# EAGLE design lada_v2 (EAGLE 7.2.0)
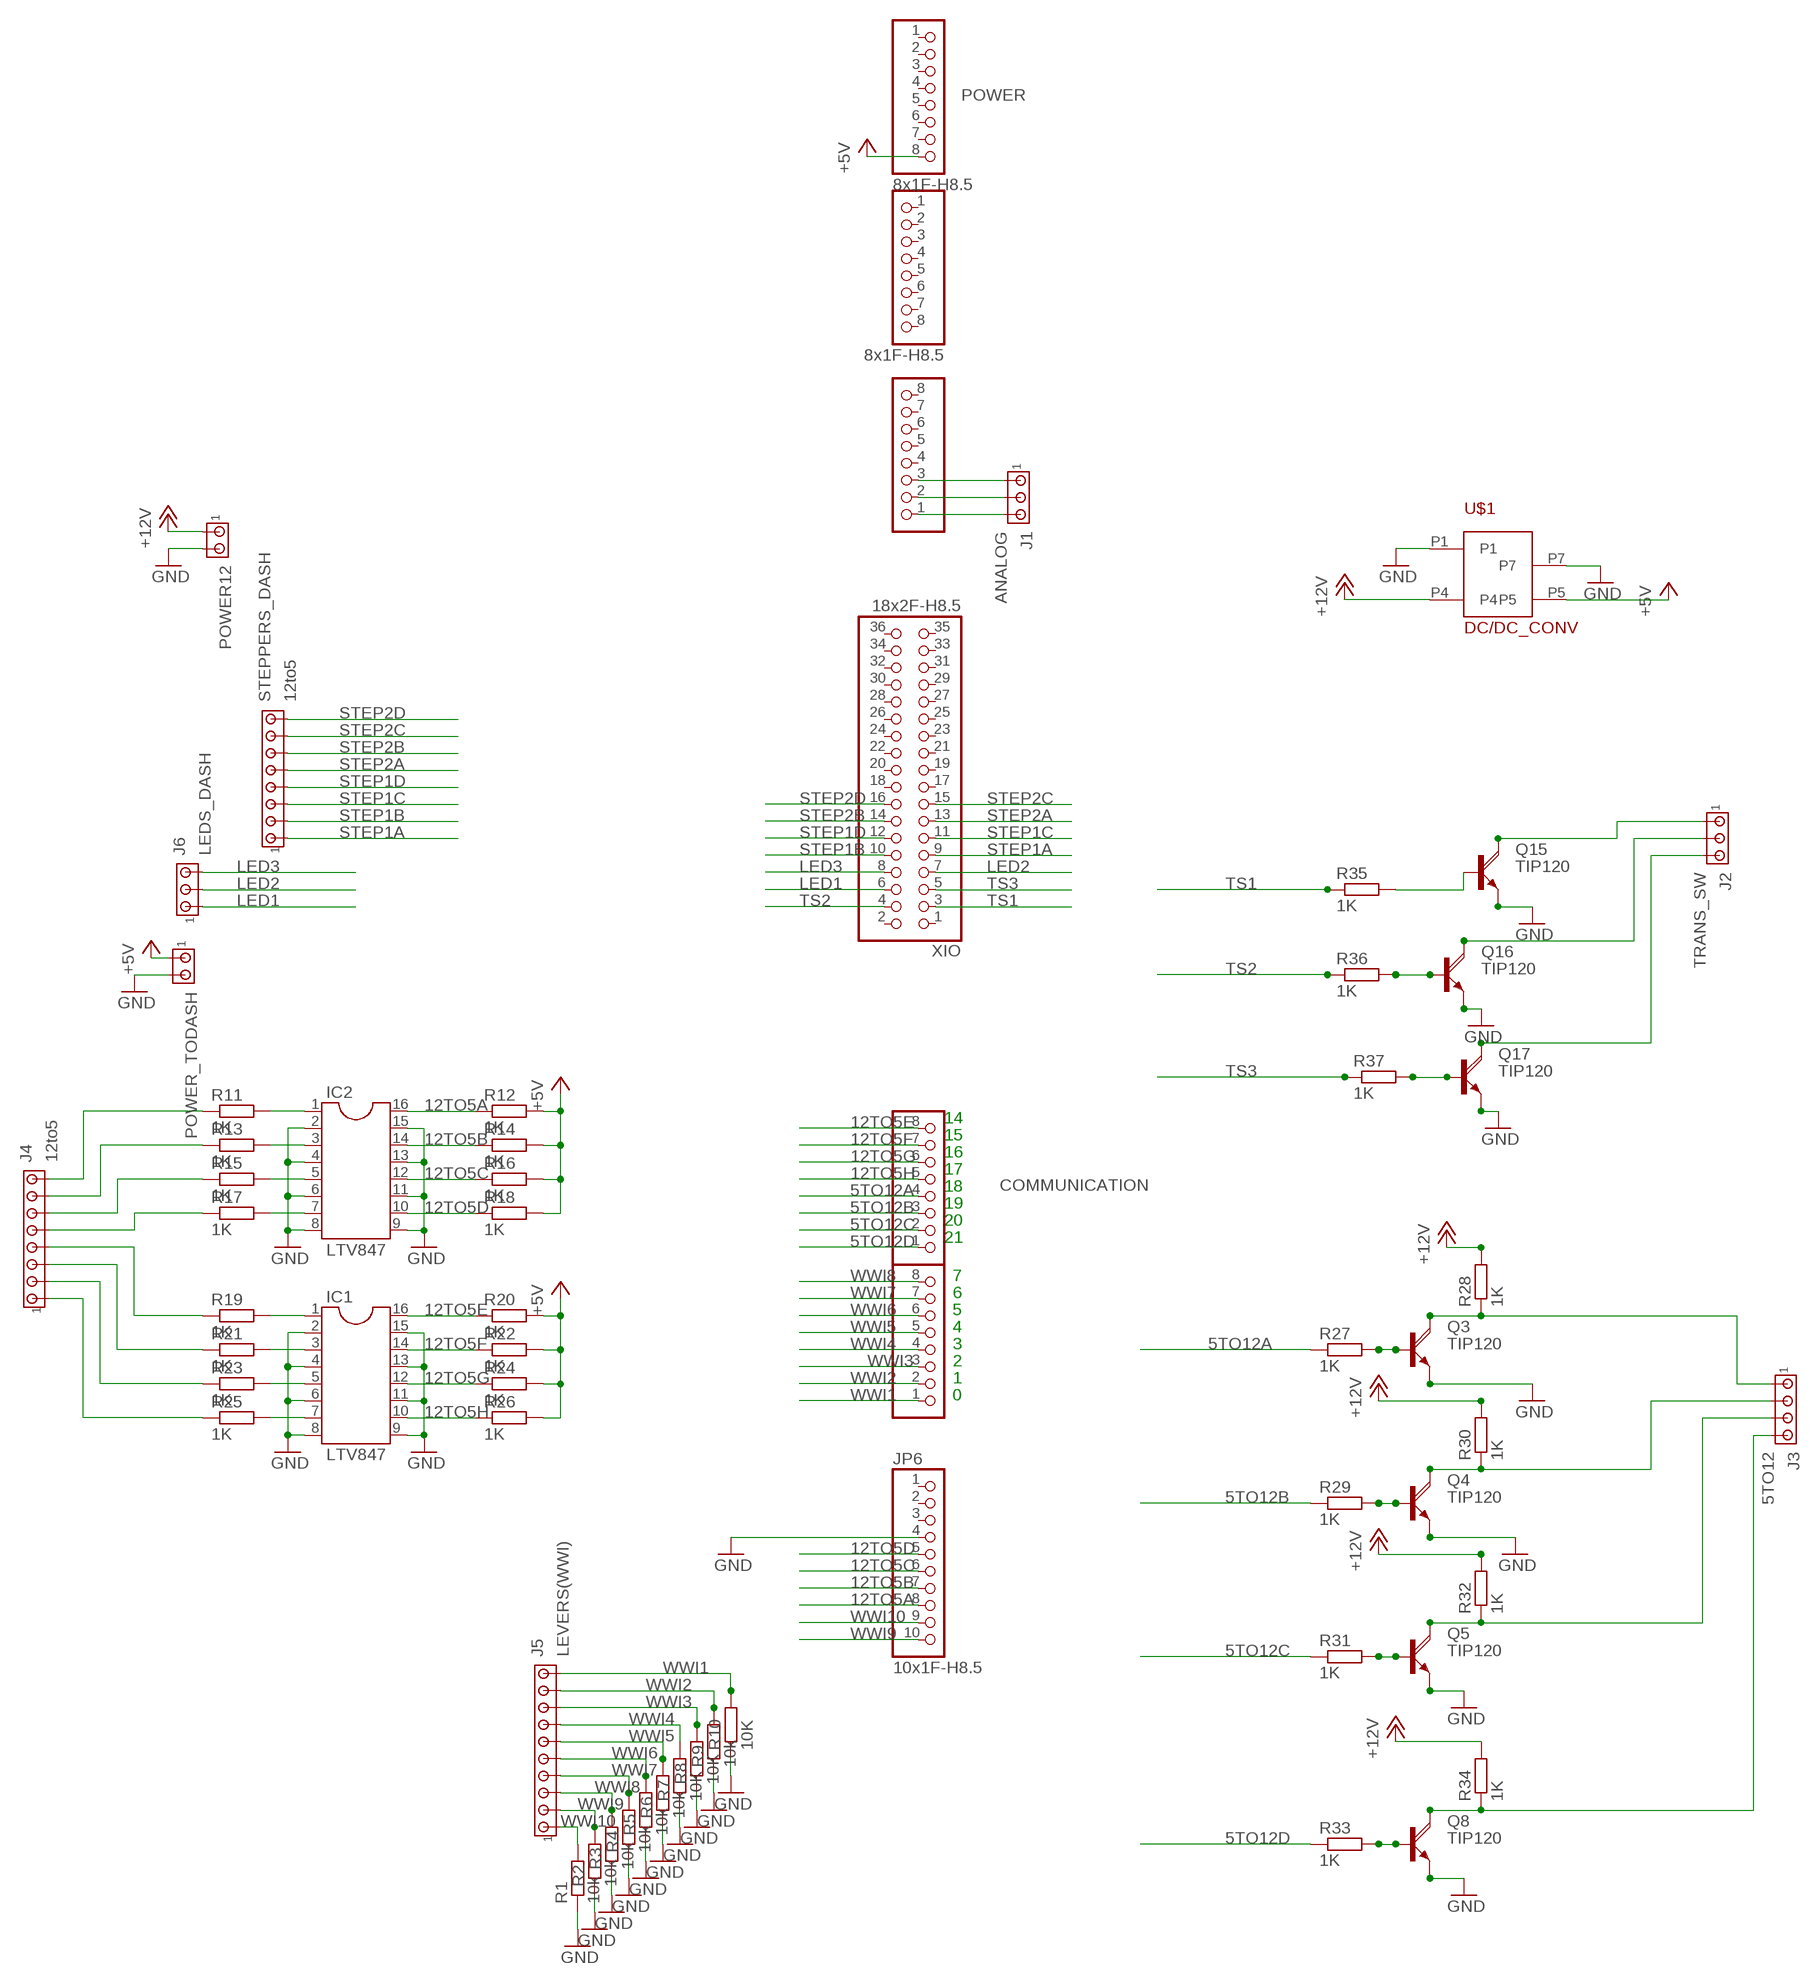
[diagram p0: schematic, sheet 1]

## Parts
ADCH  8x1F-H8.5  PINHD-1X8  [1X08]
ADCL  8x1F-H8.5  PINHD-1X8  [1X08]
COMMUNICATION  8x1F-H8.5  PINHD-1X8  [1X08]
IC1  LTV847  DIL16  [DIL16]
IC2  LTV847  DIL16  [DIL16]
J1  ANALOG  MTA03-100  [10X03MTA]
J2  TRANS_SW  MTA03-100  [10X03MTA]
J3  5TO12  MTA04-100  [10X04MTA]
J4  12to5  MTA08-100  [10X08MTA]
J5  LEVERS(WWI)  MTA10-100  [10X10MTA]
J6  LEDS_DASH  MTA03-100  [10X03MTA]
JP6  10x1F-H8.5  PINHD-1X10_ARD  [1X10]
POWER  8x1F-H8.5  PINHD-1X8  [1X08]
POWER12  MTA02-100  [10X02MTA]
POWER_TODASH  MTA02-100  [10X02MTA]
PWML  8x1F-H8.5  PINHD-1X8  [1X08]
Q3  TIP120  [TO220AH]
Q4  TIP120  [TO220AH]
Q5  TIP120  [TO220AH]
Q8  TIP120  [TO220AH]
Q15  TIP120  [TO220AH]
Q16  TIP120  [TO220AH]
Q17  TIP120  [TO220AH]
R1  10k  R-EU_0207/10  [0207/10]
R2  10k  R-EU_0207/10  [0207/10]
R3  10k  R-EU_0207/10  [0207/10]
R4  10k  R-EU_0207/10  [0207/10]
R5  10k  R-EU_0207/10  [0207/10]
R6  10k  R-EU_0207/10  [0207/10]
R7  10K  R-EU_0207/10  [0207/10]
R8  10K  R-EU_0207/10  [0207/10]
R9  10k  R-EU_0207/10  [0207/10]
R10  10K  R-EU_0207/10  [0207/10]
R11  1K  R-EU_0207/10  [0207/10]
R12  1K  R-EU_0207/10  [0207/10]
R13  1K  R-EU_0207/10  [0207/10]
R14  1K  R-EU_0207/10  [0207/10]
R15  1K  R-EU_0207/10  [0207/10]
R16  1K  R-EU_0207/10  [0207/10]
R17  1K  R-EU_0207/10  [0207/10]
R18  1K  R-EU_0207/10  [0207/10]
R19  1K  R-EU_0207/10  [0207/10]
R20  1K  R-EU_0207/10  [0207/10]
R21  1K  R-EU_0207/10  [0207/10]
R22  1K  R-EU_0207/10  [0207/10]
R23  1K  R-EU_0207/10  [0207/10]
R24  1K  R-EU_0207/10  [0207/10]
R25  1K  R-EU_0207/10  [0207/10]
R26  1K  R-EU_0207/10  [0207/10]
R27  1K  R-EU_0207/10  [0207/10]
R28  1K  R-EU_0207/10  [0207/10]
R29  1K  R-EU_0207/10  [0207/10]
R30  1K  R-EU_0207/10  [0207/10]
R31  1K  R-EU_0207/10  [0207/10]
R32  1K  R-EU_0207/10  [0207/10]
R33  1K  R-EU_0207/10  [0207/10]
R34  1K  R-EU_0207/10  [0207/10]
R35  1K  R-EU_0207/10  [0207/10]
R36  1K  R-EU_0207/10  [0207/10]
R37  1K  R-EU_0207/10  [0207/10]
STEPPERS_DASH  12to5  MTA08-100  [10X08MTA]
U$1  DC/DC_CONV  [DC/DC_CONV]
XIO  18x2F-H8.5  PINHD-2X18  [2X18]

## Nets
5TO12A: COMMUNICATION.4 R27.1
5TO12B: COMMUNICATION.3 R29.1
5TO12C: COMMUNICATION.2 R31.1
5TO12D: COMMUNICATION.1 R33.1
12TO5A: IC2.16 JP6.8 R12.1
12TO5B: IC2.14 JP6.7 R14.1
12TO5C: IC2.12 JP6.6 R16.1
12TO5D: IC2.10 JP6.5 R18.1
12TO5E: COMMUNICATION.8 IC1.16 R20.1
12TO5F: COMMUNICATION.7 IC1.14 R22.1
12TO5G: COMMUNICATION.6 IC1.12 R24.1
12TO5H: COMMUNICATION.5 IC1.10 R26.1
+5V: POWER.8 POWER_TODASH.1 R12.2 R14.2 R16.2 R18.2 R20.2 R22.2 R24.2 R26.2 U$1.P5
+12V: POWER12.1 R28.2 R30.2 R32.2 R34.2 U$1.P4
GND: IC1.2 IC1.4 IC1.6 IC1.8 IC1.9 IC1.11 IC1.13 IC1.15 IC2.2 IC2.4 IC2.6 IC2.8 IC2.9 IC2.11 IC2.13 IC2.15 JP6.4 POWER12.2 POWER_TODASH.2 Q3.E Q4.E Q5.E Q8.E Q15.E Q16.E Q17.E R1.1 R2.1 R3.1 R4.1 R5.1 R6.1 R7.1 R8.1 R9.1 R10.1 U$1.P1 U$1.P7
LED1: J6.1 XIO.6
LED2: J6.2 XIO.7
LED3: J6.3 XIO.8
N$2: ADCH.1 J1.3
N$8: Q15.B R35.2
N$9: ADCH.2 J1.2
N$11: ADCH.3 J1.1
N$60: J3.1 Q3.C R28.1
N$61: J3.2 Q4.C R30.1
N$62: J3.3 Q5.C R32.1
N$63: Q5.B R31.2
N$64: Q4.B R29.2
N$65: Q3.B R27.2
N$80: J3.4 Q8.C R34.1
N$81: Q8.B R33.2
N$100: J2.1 Q15.C
N$103: J2.2 Q16.C
N$104: Q16.B R36.2
N$106: J2.3 Q17.C
N$107: Q17.B R37.2
N$120: IC1.1 R19.2
N$121: IC1.3 R21.2
N$122: IC1.5 R23.2
N$123: IC1.7 R25.2
N$128: IC2.1 R11.2
N$129: IC2.3 R13.2
N$130: IC2.5 R15.2
N$131: IC2.7 R17.2
N$132: J4.8 R11.1
N$133: J4.7 R13.1
N$134: J4.6 R15.1
N$135: J4.5 R17.1
N$136: J4.4 R19.1
N$137: J4.3 R21.1
N$138: J4.2 R23.1
N$139: J4.1 R25.1
STEP1A: STEPPERS_DASH.1 XIO.9
STEP1B: STEPPERS_DASH.2 XIO.10
STEP1C: STEPPERS_DASH.3 XIO.11
STEP1D: STEPPERS_DASH.4 XIO.12
STEP2A: STEPPERS_DASH.5 XIO.13
STEP2B: STEPPERS_DASH.6 XIO.14
STEP2C: STEPPERS_DASH.7 XIO.15
STEP2D: STEPPERS_DASH.8 XIO.16
TS1: R35.1 XIO.3
TS2: R36.1 XIO.4
TS3: R37.1 XIO.5
WWI1: J5.10 PWML.1 R10.2
WWI2: J5.9 PWML.2 R9.2
WWI3: J5.8 PWML.3 R8.2
WWI4: J5.7 PWML.4 R7.2
WWI5: J5.6 PWML.5 R6.2
WWI6: J5.5 PWML.6 R5.2
WWI7: J5.4 PWML.7 R4.2
WWI8: J5.3 PWML.8 R3.2
WWI9: J5.2 JP6.10 R2.2
WWI10: J5.1 JP6.9 R1.2
Unconnected: ADCH.4 ADCH.5 ADCH.6 ADCH.7 ADCH.8 ADCL.1 ADCL.2 ADCL.3 ADCL.4 ADCL.5 ADCL.6 ADCL.7 ADCL.8 JP6.1 JP6.2 JP6.3 POWER.1 POWER.2 POWER.3 POWER.4 POWER.5 POWER.6 POWER.7 XIO.1 XIO.2 XIO.17 XIO.18 XIO.19 XIO.20 XIO.21 XIO.22 XIO.23 XIO.24 XIO.25 XIO.26 XIO.27 XIO.28 XIO.29 XIO.30 XIO.31 XIO.32 XIO.33 XIO.34 XIO.35 XIO.36

## Notes on the sheet
- 14
- 15
- 16
- 17
- 18
- 19
- 20
- 21
- 7
- 6
- 5
- 4
- 3
- 2
- 1
- 0

## Library data of the parts
ADCH ADCL COMMUNICATION POWER PWML = SmartPrj:PINHD-1X8: PIN HEADER
IC1 IC2 = ic-package:DIL16: Dual In Line / Socket
J1 J2 J6 = con-amp:MTA03-100: AMP connector
J3 = con-amp:MTA04-100: AMP connector
J4 STEPPERS_DASH = con-amp:MTA08-100: AMP connector
J5 = con-amp:MTA10-100: AMP connector
JP6 = SmartPrj:PINHD-1X10_ARD: PIN HEADER
POWER12 POWER_TODASH = con-amp:MTA02-100: AMP connector
Q3-Q5 Q8 Q15-Q17 = transistor-power:TIP120: NPN DARLINGTON TRANSISTOR
R1-R37 = rcl:R-EU_: RESISTOR, European symbol
U$1 = dc-dc_meanwell:DC/DC_CONV
XIO = SmartPrj:PINHD-2X18: PIN HEADER

## Net classes
0 default: width 0.203 mm, drill 0.406 mm, clearance 0.203 mm

## Board
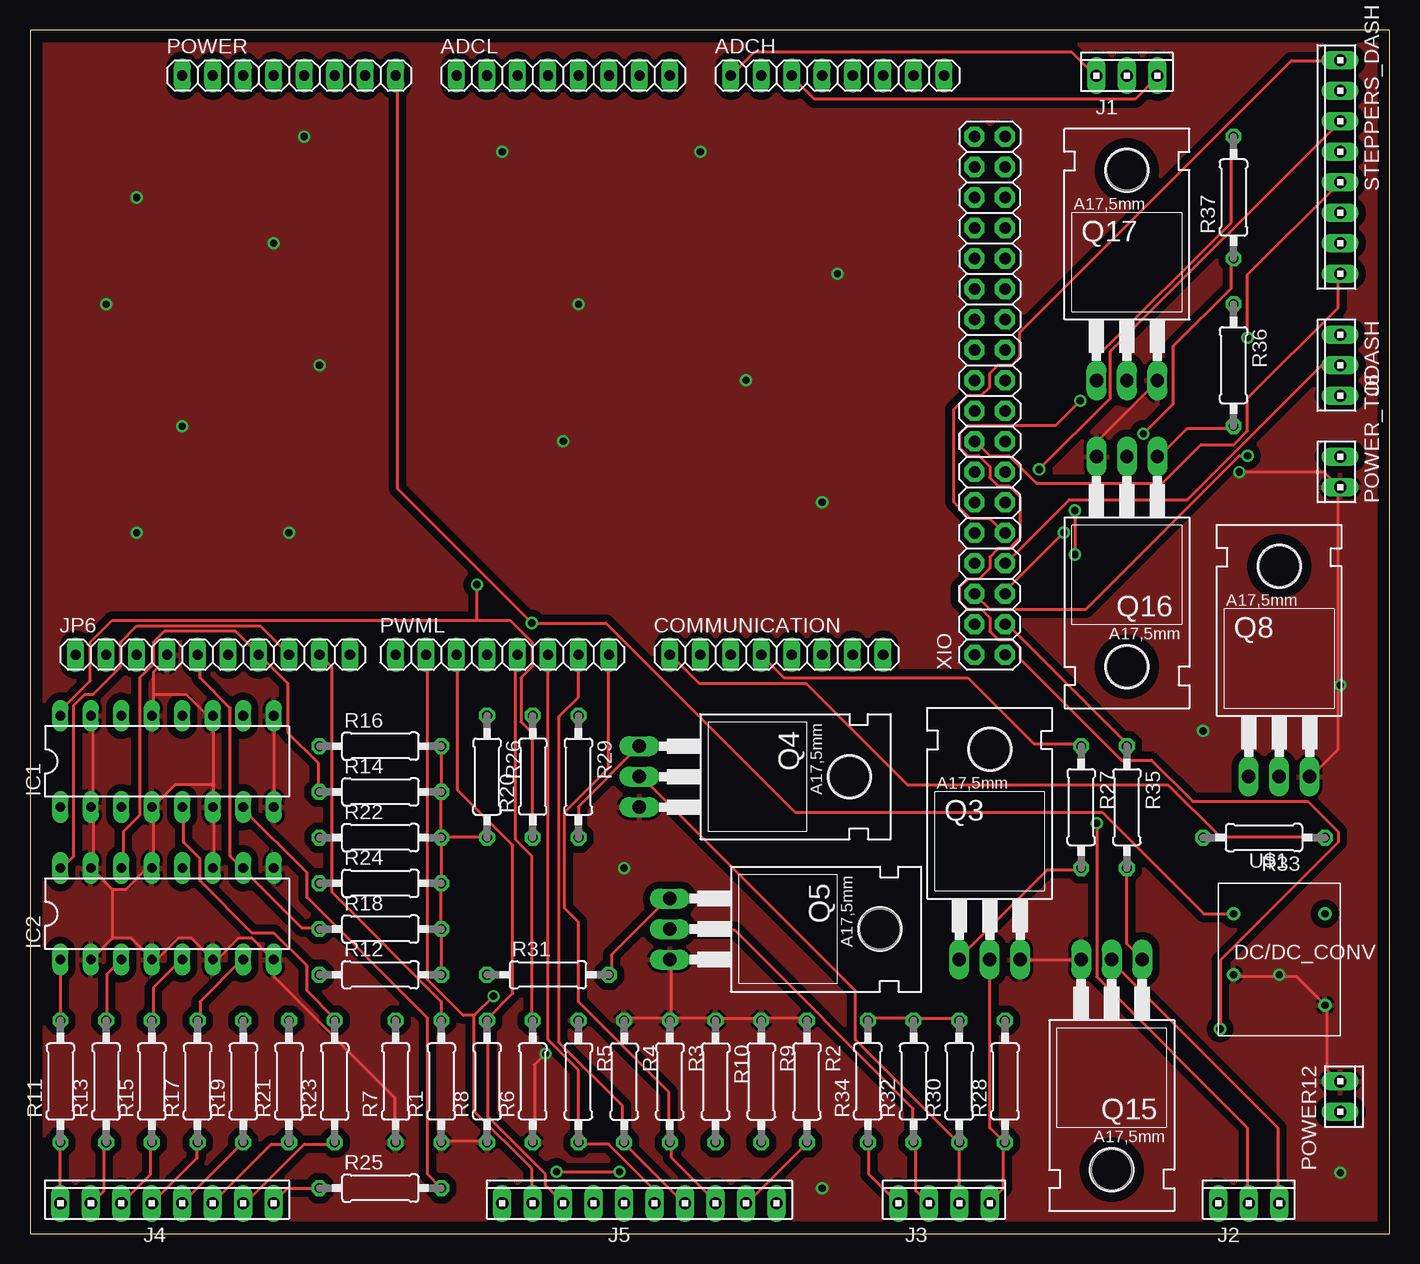
[diagram p1: board, top side]
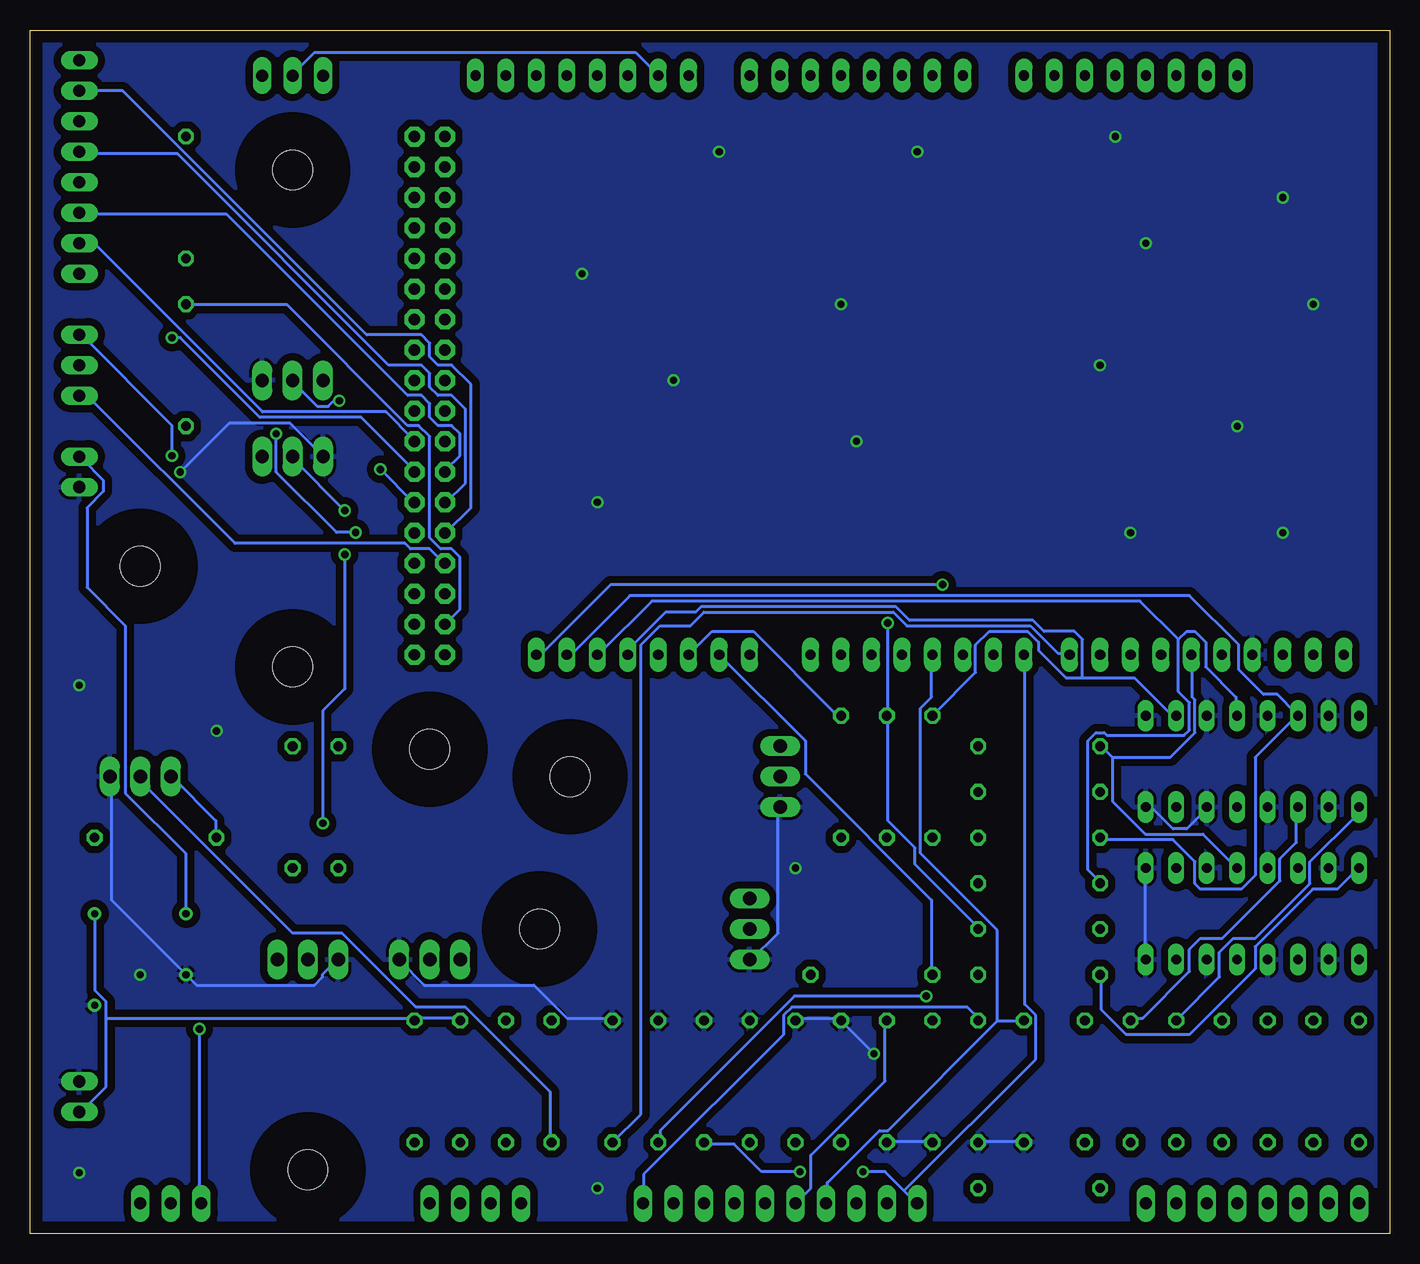
[diagram p2: board, bottom side, seen from below]

Size 113.33 x 100.32 mm. Coordinates in mm from the lower left corner, seen from the top.
Outline: 0,0 113.33,0 113.33,100.32 0,100.32 0,0
Copper layers (1*16): Top 0.035mm / dielectric 1.5mm / Bottom 0.035mm
Design rules "default *": minimum track width 10mil, minimum drill 20mil, track to track 8mil, track to pad 8mil, pad to pad 8mil, via to via 8mil, smd to smd 8mil, copper to edge 40mil, drill to drill 8mil, minimum pad ring 10mil, minimum via ring 8mil, stop-mask expansion 4mil, vias tented up to drill 0mil, thermal gap 10mil

### Footprints (pad centres in the part's own frame; a part is rotated, then mirrored left to right if it is on the bottom)
1X08 = drill 0.85 pad 1.422 long: 1 -8.89,0; 2 -6.35,0; 3 -3.81,0; 4 -1.27,0; 5 1.27,0; 6 3.81,0; 7 6.35,0; 8 8.89,0
DIL16 = drill 0.813 long: 1 -8.89,-3.81; 2 -6.35,-3.81; 3 -3.81,-3.81; 4 -1.27,-3.81; 5 1.27,-3.81; 6 3.81,-3.81; 7 6.35,-3.81; 8 8.89,-3.81; 9 8.89,3.81; 10 6.35,3.81; 11 3.81,3.81; 12 1.27,3.81; 13 -1.27,3.81; 14 -3.81,3.81; 15 -6.35,3.81; 16 -8.89,3.81
10X03MTA = drill 1.016 long: 1 2.54,0; 2 0,0; 3 -2.54,0
10X04MTA = drill 1.016 long: 1 3.81,0; 2 1.27,0; 3 -1.27,0; 4 -3.81,0
10X08MTA = drill 1.016 long: 1 8.89,0; 2 6.35,0; 3 3.81,0; 4 1.27,0; 5 -1.27,0; 6 -3.81,0; 7 -6.35,0; 8 -8.89,0
10X10MTA = drill 1.016 long: 1 11.43,0; 2 8.89,0; 3 6.35,0; 4 3.81,0; 5 1.27,0; 6 -1.27,0; 7 -3.81,0; 8 -6.35,0; 9 -8.89,0; 10 -11.43,0
1X10 = drill 0.85 pad 1.422 long: 1 -11.43,0; 2 -8.89,0; 3 -6.35,0; 4 -3.81,0; 5 -1.27,0; 6 1.27,0; 7 3.81,0; 8 6.35,0; 9 8.89,0; 10 11.43,0
10X02MTA = drill 1.016 long: 1 1.27,0; 2 -1.27,0
TO220AH = drill 1.118 long: B -2.54,-6.35; C 0,-6.35; E 2.54,-6.35 | hole 3.302: 0,11.176
0207/10 = drill 0.813 octagon: 1 -5.08,0; 2 5.08,0
DC/DC_CONV = drill 0.6: P1 8.89,2.54; P4 8.89,10.16; P5 1.27,10.16; P7 1.27,5.08
2X18 = drill 0.95 pad 1.676 octagon: 1 -21.59,-1.27; 2 -21.59,1.27; 3 -19.05,-1.27; 4 -19.05,1.27; 5 -16.51,-1.27; 6 -16.51,1.27; 7 -13.97,-1.27; 8 -13.97,1.27; 9 -11.43,-1.27; 10 -11.43,1.27; 11 -8.89,-1.27; 12 -8.89,1.27; 13 -6.35,-1.27; 14 -6.35,1.27; 15 -3.81,-1.27; 16 -3.81,1.27; 17 -1.27,-1.27; 18 -1.27,1.27; 19 1.27,-1.27; 20 1.27,1.27; 21 3.81,-1.27; 22 3.81,1.27; 23 6.35,-1.27; 24 6.35,1.27; 25 8.89,-1.27; 26 8.89,1.27; 27 11.43,-1.27; 28 11.43,1.27; 29 13.97,-1.27; 30 13.97,1.27; 31 16.51,-1.27; 32 16.51,1.27; 33 19.05,-1.27; 34 19.05,1.27; 35 21.59,-1.27; 36 21.59,1.27

### Placement (x,y rotation side)
ADCH  67.31,96.52 0 top
ADCL  44.45,96.52 0 top
COMMUNICATION  62.23,48.26 0 top
IC1  11.43,39.37 0 top
IC2  11.43,26.67 0 top
J1  91.44,96.52 0 top
J2  101.6,2.54 0 top
J3  76.2,2.54 0 top
J4  11.43,2.54 0 top
J5  50.8,2.54 0 top
J6  109.22,72.39 90 top
JP6  15.24,48.26 0 top
POWER  21.59,96.52 0 top
POWER12  109.22,11.43 270 top
POWER_TODASH  109.22,63.5 90 top
PWML  39.37,48.26 0 top
Q3  80.01,29.21 0 top
Q4  57.15,38.1 270 top
Q5  59.69,25.4 270 top
Q8  104.14,44.45 0 top
Q15  90.17,16.51 180 top
Q16  91.44,58.42 180 top
Q17  91.44,77.47 0 top
R1  34.29,12.7 90 top
R2  64.77,12.7 270 top
R3  53.34,12.7 270 top
R4  49.53,12.7 270 top
R5  45.72,12.7 270 top
R6  41.91,12.7 90 top
R7  30.48,12.7 90 top
R8  38.1,12.7 90 top
R9  60.96,12.7 270 top
R10  57.15,12.7 270 top
R11  2.54,12.7 90 top
R12  29.21,21.59 0 top
R13  6.35,12.7 90 top
R14  29.21,36.83 0 top
R15  10.16,12.7 90 top
R16  29.21,40.64 0 top
R17  13.97,12.7 90 top
R18  29.21,25.4 0 top
R19  17.78,12.7 90 top
R20  41.91,38.1 90 top
R21  21.59,12.7 90 top
R22  29.21,33.02 0 top
R23  25.4,12.7 90 top
R24  29.21,29.21 0 top
R25  29.21,3.81 0 top
R26  38.1,38.1 270 top
R27  87.63,35.56 270 top
R28  81.28,12.7 90 top
R29  45.72,38.1 270 top
R30  77.47,12.7 90 top
R31  43.18,21.59 0 top
R32  73.66,12.7 90 top
R33  102.87,33.02 180 top
R34  69.85,12.7 90 top
R35  91.44,35.56 270 top
R36  100.33,72.39 270 top
R37  100.33,86.36 90 top
STEPPERS_DASH  109.22,88.9 90 top
U$1  99.06,16.51 0 top
XIO  80.01,69.85 90 top

### Tracks (layer width: path | path; a pad name or v marks a point on that pad's centre or on a via)
5TO12A
  Top 0.254: R27.1 87.55,40.84 83.67,40.84 78.18,46.33 62.87,46.33 61.04,48.16 COMMUNICATION.4
5TO12B
  Bottom 0.254: COMMUNICATION.3 56.46,50.22 53.03,50.22 46.18,43.36 45.72,43.36 R29.1
5TO12C
  Bottom 0.254: COMMUNICATION.2 48.69,41.07 48.69,38.33 38.18,27.81 38.18,21.64 R31.1
5TO12D
  Top 0.254: R33.1 107.9,33.07 99.21,33.07 94.87,37.41 73.15,37.41 64.69,45.87 55.78,45.87 53.49,48.16 COMMUNICATION.1
12TO5A
  Top 0.254: JP6.8 21.49,48.39 19.2,50.67 8.91,50.67 7.54,49.3 7.54,47.24 5.26,44.96 4.57,44.96 3.66,44.04 3.66,31.47 2.74,30.56 IC2.16
  Bottom 0.254: R12.1 24,21.41 24,18.67 21.95,16.61 16.69,16.61 11.2,22.1 11.2,23.93 6.4,28.73 4.34,28.73 2.74,30.33 IC2.16
12TO5B
  Top 0.254: IC2.14 7.77,30.56 7.77,33.53 9.14,34.9 9.14,46.33 10.29,47.47 10.29,49.3 11.2,50.22 17.14,50.22 18.97,48.39 JP6.7 19.2,48.16 21.49,45.87 21.49,41.76 24,39.24 24,36.96 R14.1
12TO5C
  Bottom 0.254: 23.09,39.7 23.09,36.04 20.34,33.3 15.54,33.3 12.8,30.56 IC2.12 | 23.09,39.7 24,40.62 R16.1 | 23.09,39.7 18.29,39.7 16.23,41.76 16.23,44.5 16.46,44.73 16.46,48.16 JP6.6
12TO5D
  Top 0.254: R18.1 24,25.53 22.63,25.53 17.83,30.33 IC2.10 17.6,30.56 16.69,31.47 16.69,43.81 14.17,46.33 14.17,48.16 JP6.5
12TO5E  (via drill 0.61)
  Top 0.254: 37.26,51.13 6.86,51.13 5.03,49.3 5.03,46.1 2.74,43.81 2.74,43.36 IC1.16 | 37.26,51.13 40.01,51.13 41.83,49.3 41.83,47.24 40.92,46.33 40.92,42.67 41.83,41.76 41.83,33.07 R20.1 | 37.26,51.13 v37.26,54.1
  Bottom 0.254: v37.26,54.1 64.92,54.1 70.64,48.39 71.09,48.39 COMMUNICATION.8
12TO5F
  Bottom 0.254: R22.1 24,32.84 18.06,32.84 16.23,31.01 16.23,29.18 15.77,28.73 12.34,28.73 11.2,29.87 11.2,39.7 7.77,43.13 IC1.14 7.77,43.36 9.37,44.96 10.52,44.96 12.57,47.02 12.57,49.07 16.69,53.19 63.32,53.19 68.12,48.39 68.58,48.39 COMMUNICATION.7
12TO5G
  Bottom 0.254: 17.6,49.53 16.92,50.22 16.23,50.22 15.32,49.3 15.32,47.24 12.8,44.73 12.8,43.36 IC1.12 | 17.6,49.53 17.6,45.19 16.69,44.27 16.69,41.99 17.14,41.53 23.55,41.53 23.77,41.76 24.46,41.76 25.15,41.07 25.15,30.33 24.23,29.41 R24.1 | 17.6,49.53 20.8,52.73 61.49,52.73 65.84,48.39 COMMUNICATION.6
12TO5H
  Bottom 0.254: 25.6,46.33 26.98,46.33 29.26,48.62 29.26,49.3 30.18,50.22 33.38,50.22 34.52,49.07 34.52,46.79 37.95,43.36 R26.1 | 25.6,46.33 21.26,46.33 18.29,43.36 17.83,43.36 IC1.10 | 25.6,46.33 25.6,49.53 26.29,50.22 28.8,50.22 29.72,51.13 40.01,51.13 41.15,52.27 57.38,52.27 57.84,51.82 60.35,51.82 63.32,48.84 63.32,48.39 COMMUNICATION.5
+5V  (via drill 0.61)
  Top 0.254: R16.2 R14.2 34.29,33.07 | 34.29,33.07 37.95,33.07 R26.2 | 34.29,33.07 R22.2 R24.2 R18.2 R12.2 | POWER.8 30.63,96.39 30.63,62.1 v41.83,50.9 48.01,50.9 63.78,35.13 89.38,35.13 97.84,26.67 U$1.P5
  Bottom 0.254: U$1.P5 100.36,26.67 100.36,31.7 105.39,36.73 105.39,50.67 108.58,53.87 108.58,60.5 107.21,61.87 107.21,62.79 109.04,64.62 POWER_TODASH.1 | R18.2 34.29,25.53 39.55,30.79 39.55,32.16 41.83,34.44 41.83,43.13 R20.2 41.83,43.36 v41.83,50.9
+12V
  Top 0.254: R34.2 69.95,17.98 73.61,17.98 R32.2 73.84,17.98 77.27,17.98 R30.2
  Bottom 0.254: R30.2 77.5,17.98 81.15,17.98 R28.2 81.38,17.98 106.98,17.98 | 106.98,17.98 106.98,12.27 109.04,10.21 POWER12.1 | 106.98,17.98 106.98,19.36 107.9,20.27 107.9,26.67 U$1.P4
GND  (via drill 0.6, 0.61)
  Top 0.254: 6.86,24.61 5.26,23.01 IC2.2 | 6.86,24.61 8.46,24.61 10.06,23.01 IC2.4 10.29,23.01 10.74,23.01 12.34,24.61 13.49,24.61 IC2.6 15.32,23.01 15.77,23.01 17.37,24.61 18.52,24.61 20.12,23.01 IC2.8 20.34,22.78 20.34,21.41 30.4,11.35 30.4,7.7 R7.1 | IC1.15 5.26,43.13 5.26,35.59 IC1.2 5.26,35.36 5.26,30.56 IC2.15 5.26,30.33 6.86,28.73 | 6.86,28.73 6.86,24.61 | 6.86,28.73 8,28.73 9.6,30.33 10.06,30.33 IC2.13 10.29,30.56 10.29,35.36 IC1.4 10.29,35.59 12.12,37.41 15.32,37.41 | 10.29,44.96 10.29,46.79 11.43,47.93 JP6.4 | 10.29,44.96 10.29,43.36 IC1.13 | 10.29,44.96 13.03,44.96 14.63,43.36 15.09,43.36 IC1.11 15.32,43.13 15.32,37.41 | IC2.11 15.32,30.56 15.32,35.36 IC1.6 15.32,35.59 15.32,37.41 | IC1.9 20.34,43.13 20.34,35.59 IC1.8 | R1.1 34.29,7.7 37.95,7.7 R8.1 | Q16.E 88.92,64.85 88.92,65.99 93.95,71.02 Q17.E | Q8.E 106.76,38.1 109.04,40.39 109.04,62.1 POWER_TODASH.2 109.04,62.33 107.9,63.48 v100.81,63.48 | R2.1 64.69,17.98 61.04,17.98 R9.1 60.81,17.98 57.15,17.98 | 57.15,17.98 53.49,17.98 | 53.49,17.98 53.49,22.78 Q5.E | 53.49,17.98 R3.1 53.26,17.98 49.61,17.98 R4.1 | 57.15,17.98 R10.1 | Q3.E 82.75,22.78 87.55,22.78 Q15.E | POWER12.2 109.04,12.72 108.13,13.64 108.13,18.9 U$1.P1 107.9,19.13 105.61,21.41 100.36,21.41 U$1.P7 | v42.98,15.01 42.06,14.1 42.06,7.7 R6.1
  Bottom 0.254: IC1.8 20.12,35.36 19.66,35.36 18.06,33.76 16.92,33.76 15.32,35.36 IC1.6 | R7.1 30.63,7.7 34.29,7.7 R1.1 | R8.1 38.18,7.7 41.83,7.7 R6.1 | IC2.9 20.34,30.33 20.34,23.01 IC2.8 | v100.81,63.48 96.7,67.59 91.67,67.59 88.92,64.85 Q16.E | R4.1 49.38,17.98 45.72,17.98 R5.1 45.72,17.75 v42.98,15.01 | Q4.E 50.98,35.36 50.98,25.07 53.26,22.78 Q5.E | Q15.E 87.78,22.78 88.92,21.64 88.92,21.41 89.61,20.73 99.44,20.73 100.13,21.41 U$1.P7 100.36,21.64 106.53,27.81 106.53,38.1 Q8.E | R2.1 64.92,17.98 68.58,17.98 71.32,20.73 80.47,20.73 82.53,22.78 Q3.E
  other vias: 97.79,41.91 109.22,45.72 49.53,30.48 66.04,3.81 109.22,5.08 104.14,21.59 8.89,58.42 12.7,67.31 21.59,58.42 24.13,72.39 6.35,77.47 20.32,82.55 8.89,86.36 22.86,91.44 39.37,90.17 55.88,90.17 45.72,77.47 67.31,80.01 59.69,71.12 44.45,66.04 66.04,60.96
  pour Bottom (isolate 0.61): 0,100.33 113.03,100.33 113.03,0 0,0
  pour Top (isolate 0.61): 0,100.33 113.03,100.33 113.03,0 0,0
LED1  (via drill 0.61)
  Top 0.254: v101.5,64.85 100.81,64.85 88.01,52.05 80.01,52.05 78.87,53.19 XIO.6
  Bottom 0.254: v101.5,64.85 101.5,67.36 109.04,74.91 J6.1
LED2
  Top 0.254: J6.2 107.67,72.39 96.47,61.19 86.64,61.19 81.38,55.93 XIO.7
LED3
  Bottom 0.254: J6.3 109.04,69.65 108.36,69.65 96.24,57.53 82.07,57.53 81.61,57.07 80.01,57.07 78.87,55.93 XIO.8
N$2
  Top 0.254: ADCH.1 60.35,98.45 86.87,98.45 88.7,96.62 J1.3
N$8
  Top 0.254: R35.2 91.44,24.16 92.58,23.01 Q15.B
N$9
  Bottom 0.254: ADCH.2 61.04,96.62 62.87,98.45 89.61,98.45 91.44,96.62 J1.2
N$11
  Top 0.254: ADCH.3 63.55,96.39 65.38,94.56 92.13,94.56 93.95,96.39 J1.1
N$60
  Top 0.254: J3.1 80.01,2.67 81.15,3.81 81.15,7.47 R28.1 81.15,7.7 80.01,8.84 Q3.C
N$61
  Top 0.254: J3.2 77.5,2.67 77.5,7.47 R30.1 77.27,7.7 68.81,16.15 68.81,20.27 50.98,38.1 Q4.C
N$62
  Top 0.254: J3.3 74.75,2.67 73.84,3.58 73.84,7.47 R32.1 73.61,7.7 73.61,10.44 58.75,25.3 53.49,25.3 Q5.C
N$63
  Top 0.254: R31.2 48.46,21.64 48.46,23.24 53.26,28.04 Q5.B
N$64
  Top 0.254: R29.2 45.72,35.59 50.75,40.62 Q4.B
N$65
  Top 0.254: R27.2 87.55,30.33 84.81,30.33 77.5,23.01 Q3.B
N$80
  Top 0.254: R34.1 69.95,7.47 69.95,4.95 72.24,2.67 J3.4
  Bottom 0.254: Q8.C 104.01,38.1 104.01,37.64 91.44,25.07 87.33,25.07 81.15,18.9 77.04,18.9 69.95,11.81 69.95,7.7 R34.1
N$81
  Bottom 0.254: R33.2 97.84,33.07 97.84,34.44 101.5,38.1 Q8.B
N$100
  Top 0.254: J2.1 104.01,2.67 104.01,8.84 90.07,22.78 Q15.C
N$103  (via drill 0.61)
  Top 0.254: v88.92,34.21 88.92,21.41 101.5,8.84 101.5,2.67 J2.2 | v87.1,60.27 v87.1,56.62
  Bottom 0.254: v88.92,34.21 88.92,43.59 87.1,45.41 v87.1,56.62 | v87.1,60.27 91.44,64.62 Q16.C
N$104
  Top 0.254: R36.2 100.13,67.13 96.47,67.13 94.18,64.85 Q16.B
N$106  (via drill 0.61)
  Top 0.254: v99.21,17.07 99.21,22.78 109.04,32.61 109.04,33.53 106.53,36.04 96.93,36.04 93.5,39.47 90.98,39.47 82.53,47.93 82.53,48.84 81.84,49.53 80.7,49.53 80.01,50.22 80.01,51.36 79.32,52.05 78.18,52.05 77.5,52.73 77.5,53.87 78.18,54.56 79.1,54.56 80.01,55.47 80.01,56.39 80.7,57.07 81.61,57.07 82.53,57.99 82.53,61.42 81.61,62.33 80.7,62.33 80.01,63.02 80.01,63.93 79.1,64.85 78.18,64.85 77.5,65.53 77.5,66.67 78.18,67.36 85.5,67.36 v87.55,69.42
  Bottom 0.254: v99.21,17.07 99.21,2.67 J2.3 | v87.55,69.42 88.01,69.42 88.47,68.96 89.38,68.96 91.44,71.02 Q17.C
N$107
  Top 0.254: R37.2 100.13,91.36 100.13,84.28 88.92,73.08 88.92,71.25 Q17.B
N$120
  Bottom 0.254: IC1.1 2.74,35.36 2.74,34.9 6.63,31.01 6.63,29.18 11.2,24.61 13.03,24.61 14.17,23.47 14.17,21.41 17.6,17.98 R19.2
N$121
  Bottom 0.254: IC1.3 7.77,35.36 7.77,32.61 9.14,31.24 9.14,29.41 13.95,24.61 15.77,24.61 16.69,23.7 16.69,21.87 20.57,17.98 21.49,17.98 R21.2
N$122
  Top 0.254: IC1.5 12.8,35.36 12.8,32.61 14.17,31.24 14.17,29.41 18.52,25.07 20.34,25.07 23.09,22.33 23.09,20.27 25.38,17.98 R23.2
N$123
  Top 0.254: R25.2 33.15,4.95 33.15,17.98 23.09,28.04 23.09,30.1 17.83,35.36 IC1.7
N$128
  Top 0.254: R11.2 2.52,17.98 2.52,22.78 IC2.1
N$129
  Top 0.254: IC2.3 6.4,21.64 6.4,17.98 R13.2
N$130
  Top 0.254: R15.2 10.29,17.98 10.29,20.5 12.57,22.78 IC2.5
N$131
  Top 0.254: R17.2 14.17,17.98 14.17,19.36 17.6,22.78 IC2.7
N$132
  Top 0.254: R11.1 2.52,7.47 2.52,2.67 J4.8
N$133
  Top 0.254: R13.1 6.17,7.47 6.17,3.58 5.26,2.67 J4.7
N$134
  Top 0.254: R15.1 10.06,7.47 10.06,4.95 7.77,2.67 J4.6
N$135
  Top 0.254: J4.5 13.95,6.33 13.95,7.47 R17.1
N$136
  Top 0.254: R19.1 17.6,7.47 12.8,2.67 J4.4
N$137
  Top 0.254: R21.1 21.49,7.47 20.12,7.47 15.32,2.67 J4.3
N$138
  Top 0.254: R23.1 25.38,7.47 22.86,7.47 17.83,2.44 J4.2
N$139
  Top 0.254: R25.1 21.49,3.81 20.34,2.67 J4.1
STEP1A
  Top 0.254: STEPPERS_DASH.1 109.04,97.77 105.16,97.77 82.53,75.13 82.53,73.08 81.84,72.39 80.7,72.39 80.01,71.7 80.01,70.56 79.32,69.88 78.18,69.88 77.04,68.73 77.04,60.96 78.41,59.59 80.01,59.59 81.15,58.45 XIO.9
STEP1B
  Bottom 0.254: STEPPERS_DASH.2 105.61,95.25 85.27,74.91 80.7,74.91 80.01,74.22 80.01,73.08 79.32,72.39 78.18,72.39 76.58,70.79 76.58,60.5 78.64,58.45 XIO.10
STEP1C  (via drill 0.61)
  Top 0.254: v84.12,63.7 90.07,69.65 90.07,73.53 109.04,92.51 STEPPERS_DASH.3
  Bottom 0.254: v84.12,63.7 81.38,60.96 XIO.11
STEP1D
  Bottom 0.254: STEPPERS_DASH.4 109.04,89.99 101.04,89.99 83.44,72.39 80.7,72.39 80.01,71.7 80.01,70.56 79.32,69.88 78.18,69.88 77.04,68.73 77.04,62.56 78.64,60.96 XIO.12
STEP2A  (via drill 0.61)
  Top 0.254: v101.5,74.68 101.5,79.93 109.04,87.48 STEPPERS_DASH.5
  Bottom 0.254: v101.5,74.68 100.81,74.68 94.18,68.05 85.72,68.05 81.38,63.7 XIO.13
STEP2B
  Bottom 0.254: STEPPERS_DASH.6 109.04,84.96 96.93,84.96 81.84,69.88 80.7,69.88 80.01,69.19 80.01,68.05 79.32,67.36 78.18,67.36 77.5,66.67 77.5,64.85 78.64,63.7 XIO.14
STEP2C
  Bottom 0.254: STEPPERS_DASH.7 109.04,82.45 107.9,82.45 93.95,68.5 83.67,68.5 81.38,66.22 XIO.15
STEP2D
  Top 0.254: STEPPERS_DASH.8 109.04,79.93 109.04,77.19 101.5,69.65 101.5,66.9 100.36,65.76 97.61,65.76 94.41,62.56 83.9,62.56 81.61,64.85 80.01,64.85 78.87,65.99 XIO.16
TS1
  Top 0.254: R35.1 91.44,40.84 81.38,50.9 XIO.3
TS2
  Bottom 0.254: XIO.4 77.5,52.05 77.5,56.39 78.18,57.07 79.1,57.07 80.01,57.99 80.01,66.45 80.92,67.36 81.84,67.36 91.9,77.42 100.13,77.42 R36.1
TS3  (via drill 0.61)
  Top 0.254: v92.81,66.67 95.33,69.19 95.33,73.99 100.13,78.79 100.13,81.08 R37.1 | v86.18,58.45 81.15,53.42 XIO.5
  Bottom 0.254: v92.81,66.67 92.81,63.48 87.78,58.45 v86.18,58.45
WWI1  (via drill 0.61)
  Top 0.254: v43.89,5.18 v49.15,5.18
  Bottom 0.254: v49.15,5.18 52.35,5.18 54.63,7.47 57.15,7.47 R10.2 | v43.89,5.18 42.06,5.18 40.46,3.58 | 40.46,3.58 39.55,2.67 J5.10 | 40.46,3.58 29.49,14.55 29.49,18.21 30.4,19.13 30.4,48.16 PWML.1
WWI2  (via drill 0.61)
  Top 0.254: 37.03,18.21 v38.63,19.81 | 37.03,18.21 37.03,10.21 41.83,5.41 41.83,2.67 J5.9 | 37.03,18.21 36.12,18.21 33.15,21.18 33.15,48.16 PWML.2
  Bottom 0.254: v38.63,19.81 49.61,19.81 60.81,8.61 60.81,7.7 R9.2
WWI3
  Top 0.254: J5.8 44.35,2.67 42.98,4.04 42.98,4.95 38.18,9.75 38.18,17.75 R8.2 38.18,17.98 40.23,20.04 40.23,32.38 35.66,36.96 35.66,48.16 PWML.3
WWI4
  Bottom 0.254: 32.69,17.75 30.63,17.75 R7.2 | 32.69,17.75 41.83,8.61 42.52,8.61 46.86,4.27 46.86,2.67 J5.7 | 32.69,17.75 32.69,25.3 39.09,31.7 39.09,43.81 38.18,44.73 38.18,48.16 PWML.4
WWI5
  Top 0.254: PWML.5 40.46,48.16 40.46,32.84 41.83,31.47 41.83,17.98 R6.2
  Bottom 0.254: R6.2 42.06,17.75 42.06,12.72 48.23,6.55 48.23,3.81 49.38,2.67 J5.6
WWI6
  Top 0.254: J5.5 51.89,2.67 51.89,3.81 48.23,7.47 45.72,7.47 R5.2 45.72,13.64 43.2,16.15 43.2,48.16 PWML.6
WWI7
  Top 0.254: J5.4 54.41,2.67 49.61,7.47 R4.2 49.38,7.7 49.38,10.67 44.12,15.93 44.12,43.13 45.72,44.73 PWML.7
WWI8
  Top 0.254: J5.3 57.15,2.67 53.49,6.33 53.49,7.47 R3.2 53.26,7.7 53.26,11.81 45.72,19.36 45.72,25.98 44.58,27.13 44.58,35.13 48.23,38.79 48.23,48.16 PWML.8
WWI9
  Top 0.254: R2.2 64.69,7.47 59.89,2.67 J5.2
  Bottom 0.254: R2.2 62.41,9.98 62.41,49.07 60.81,50.67 58.29,50.67 57.15,51.82 41.38,51.82 40.23,50.67 29.95,50.67 27.66,48.39 26.75,48.39 JP6.10
WWI10
  Top 0.254: R1.2 34.29,19.36 25.15,28.5 25.15,47.24 JP6.9
  Bottom 0.254: J5.1 62.18,2.67 62.18,4.95 50.52,16.61 50.52,18.21 49.84,18.9 35.2,18.9 34.29,17.98 R1.2